# EAGLE design makeict-security-server-V2016-3-29 (EAGLE 7.5.0)
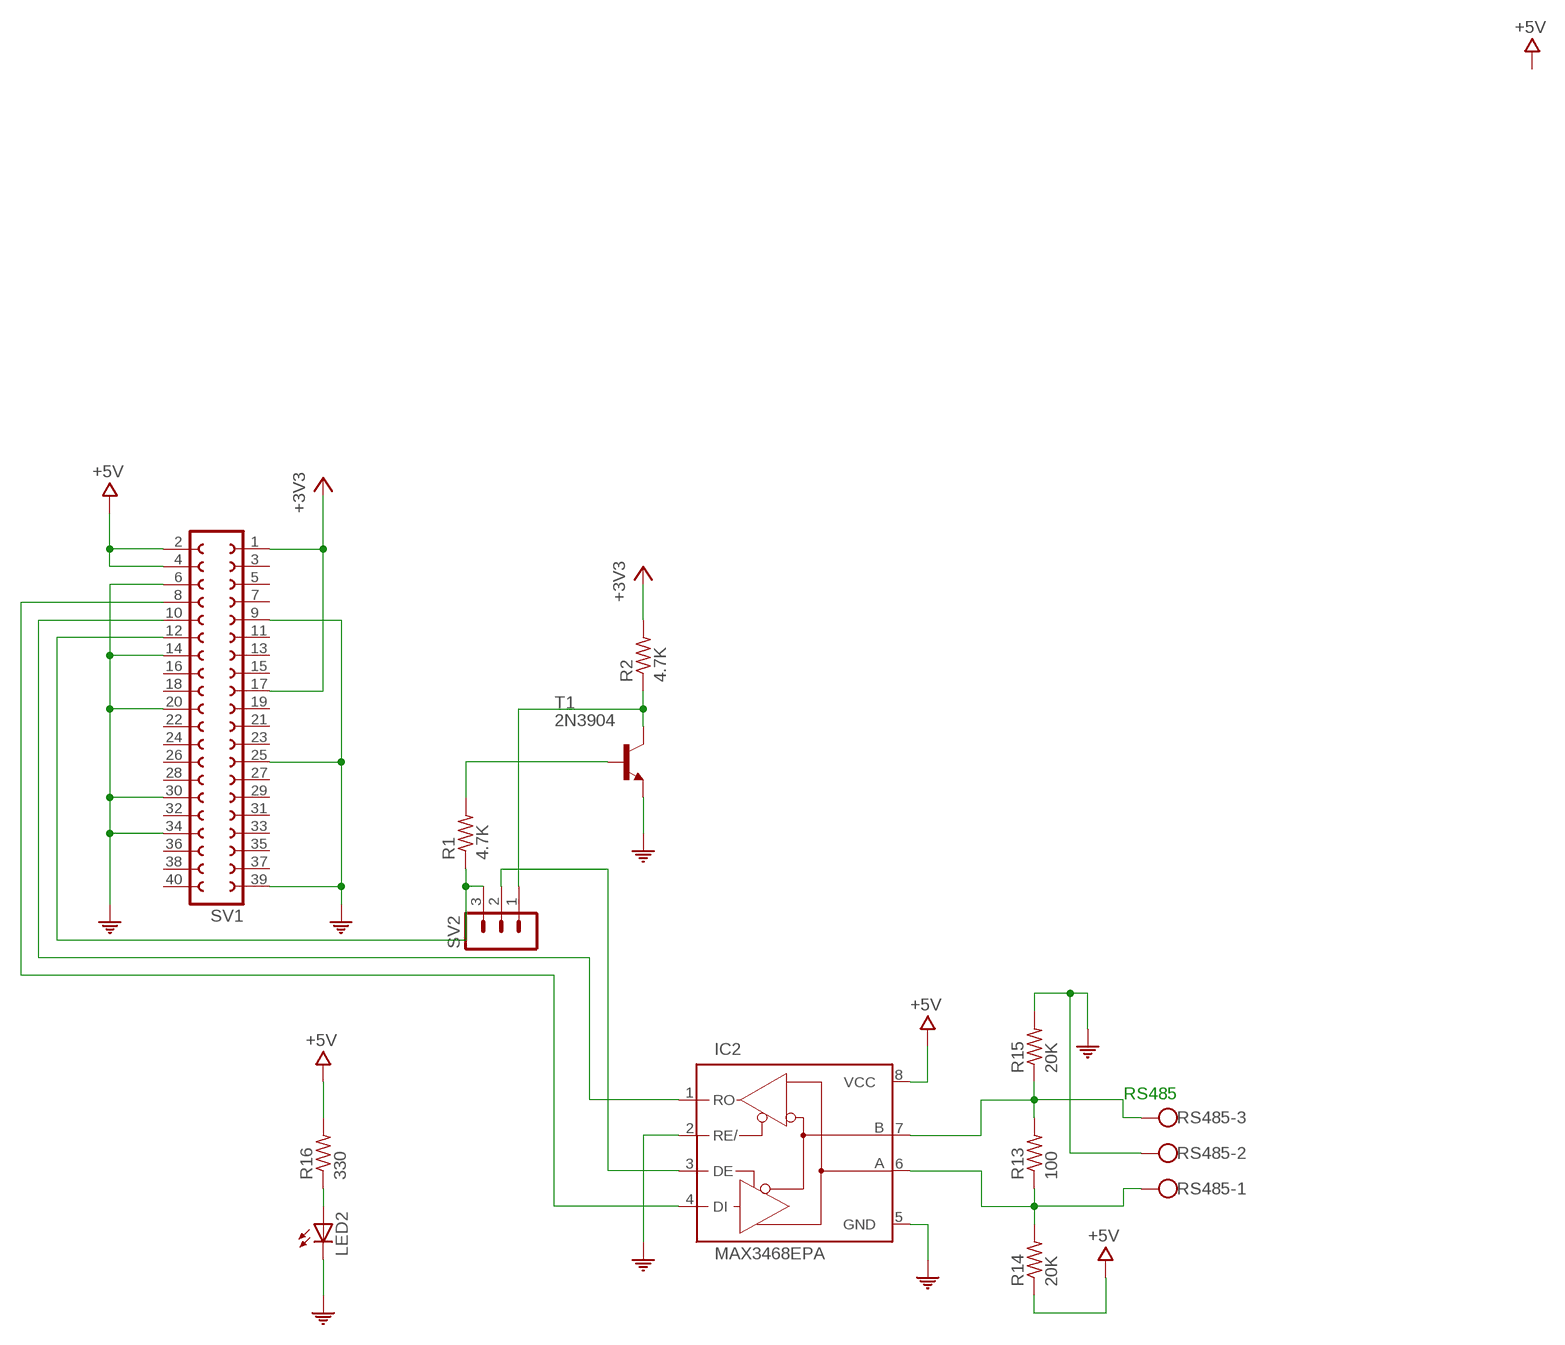
[diagram p0: schematic, sheet 1]

## Parts
IC2  MAX3468EPA  [DIL08]
LED2  LED3MM  [LED3MM]
R1  4.7K  R-US_0207/10  [0207/10]
R2  4.7K  R-US_0207/10  [0207/10]
R13  100  R-US_0207/10  [0207/10]
R14  20K  R-US_0207/10  [0207/10]
R15  20K  R-US_0207/10  [0207/10]
R16  330  R-US_0207/10  [0207/10]
RS485  W237-103  [W237-103]
SV1  FE20-2  [FE20-2]
SV2  MA03-1  [MA03-1]
T1  2N3904  [TO92]

## Nets
+3V3: R2.2 SV1.1 SV1.17
+5V: IC2.8(VCC) R14.1 R16.2 SV1.2 SV1.4
COM: IC2.2(RE/) IC2.5(GND) LED2.K(C) R15.2 RS485.2 SV1.6 SV1.9 SV1.14 SV1.20 SV1.25 SV1.30 SV1.34 SV1.39 T1.3(E)
D7: IC2.4(DI) SV1.8
D8: IC2.3(DE) SV2.2
N$1: R1.1 SV1.12 SV2.3
N$2: R1.2 T1.2(B)
N$3: R2.1 SV2.1 T1.1(C)
N$4: IC2.7(B) R13.2 R15.1 RS485.3
N$5: IC2.6(A) R13.1 R14.2 RS485.1
N$12: LED2.A R16.1
N$24: IC2.1(RO) SV1.10
Unconnected: SV1.3 SV1.5 SV1.7 SV1.11 SV1.13 SV1.15 SV1.16 SV1.18 SV1.19 SV1.21 SV1.22 SV1.23 SV1.24 SV1.26 SV1.27 SV1.28 SV1.29 SV1.31 SV1.32 SV1.33 SV1.35 SV1.36 SV1.37 SV1.38 SV1.40

## Notes on the sheet
- RS485

## Library data of the parts
IC2 = maxim:MAX34*: +5V, Fail-Safe, 40Mbps, Profibus RS-485/RS-422 Transceivers Source: MAX3465-MAX3469.pdf; MPN: MAX3468EPA+; OC_FARNELL: unknown; OC_NEWARK: 78M5804
LED2 = SparkFun-LED:LED: LEDs Standard schematic elements and footprints for 5mm, 3mm, 1206, and 0603 sized LEDs. 5mm - Spark Fun Electronics SKU : COM-00529 (and others)
R1 R2 R13-R16 = resistor:R-US_: RESISTOR, American symbol
RS485 = con-wago-500:W237-103: WAGO SCREW CLAMP; MPN: 237-103; OC_FARNELL: unknown; OC_NEWARK: 18M7116
SV1 = con-lsta:FE20-2: FEMALE HEADER; OC_FARNELL: unknown; OC_NEWARK: unknown
SV2 = con-lstb:MA03-1: PIN HEADER; OC_FARNELL: unknown; OC_NEWARK: unknown
T1 = transistor:2N3904: NPN TRANSISTOR

## Board
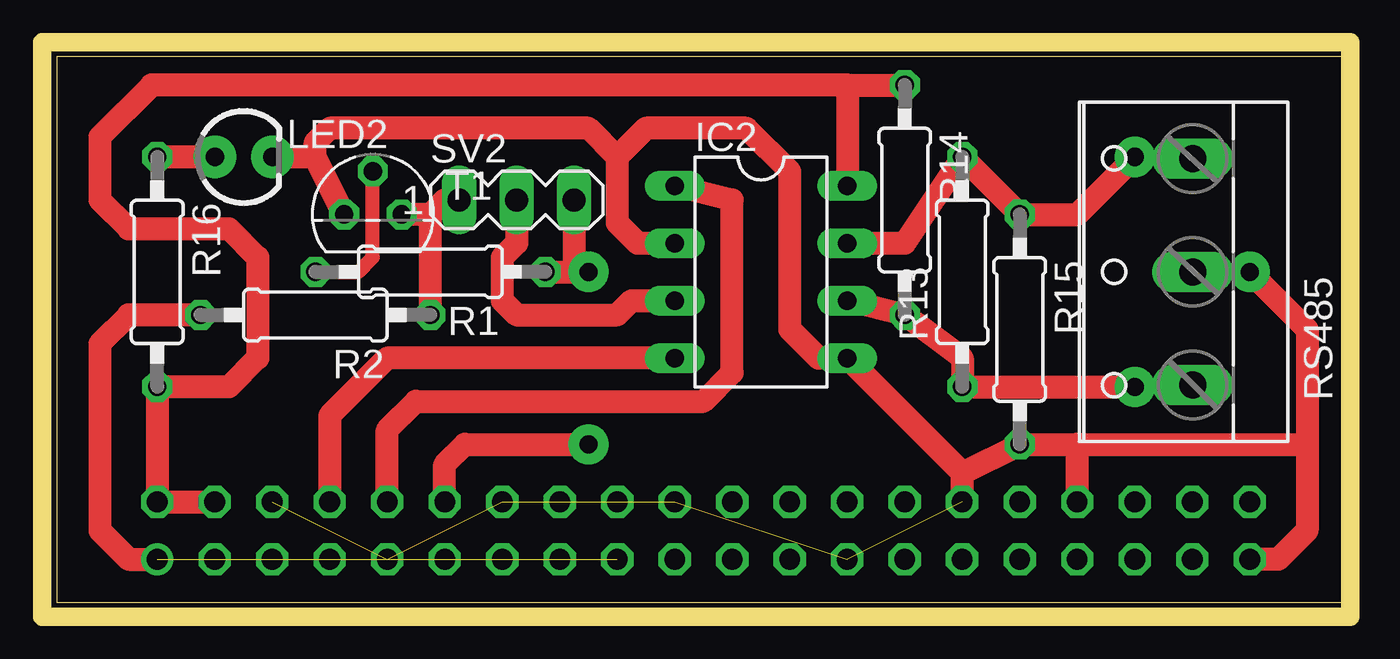
[diagram p1: board, top side]
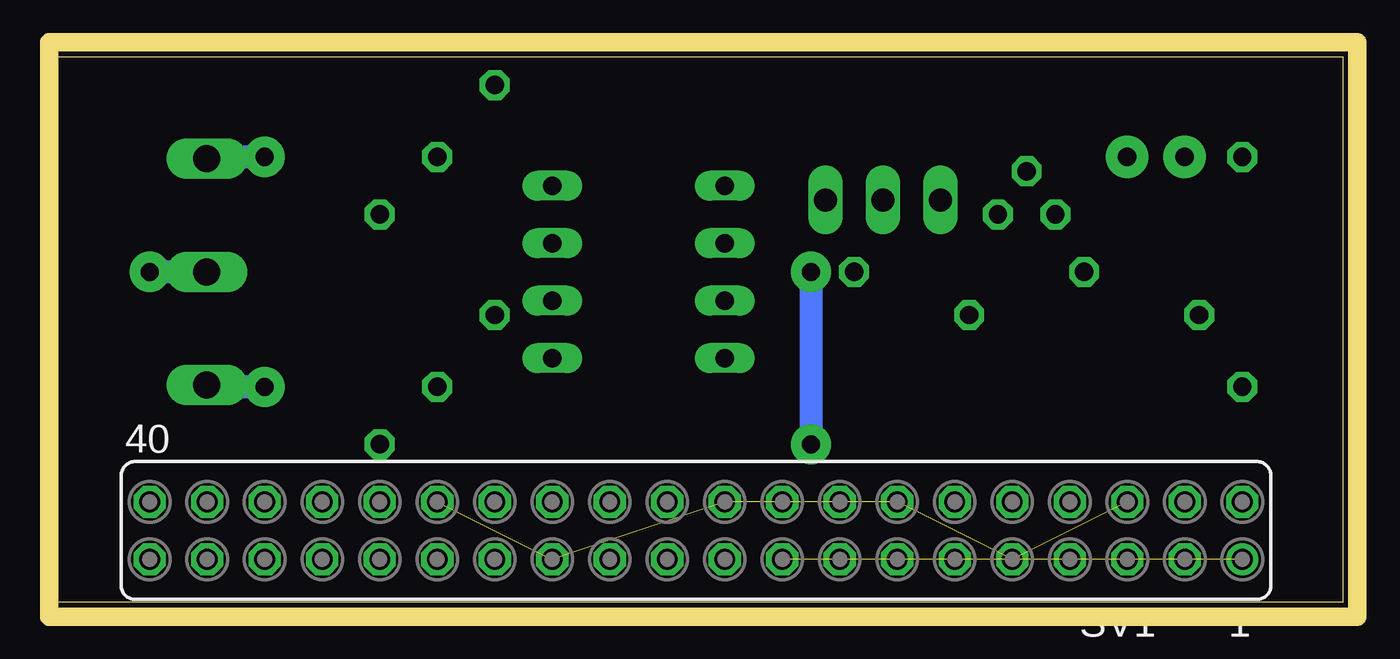
[diagram p2: board, bottom side, seen from below]

Size 56.82 x 24.12 mm. Coordinates in mm from the lower left corner, seen from the top.
Outline: 0,0 56.82,0 56.82,24.12 0,24.12 0,0
Copper layers (1*16): Top 0.035mm / dielectric 1.5mm / Bottom 0.035mm
Design rules "default": minimum track width 10mil, minimum drill 24mil, track to track 8mil, track to pad 8mil, pad to pad 8mil, via to via 8mil, smd to smd 8mil, copper to edge 40mil, drill to drill 8mil, minimum pad ring 10mil, minimum via ring 8mil, stop-mask expansion 4mil, vias tented up to drill 0mil, thermal gap 10mil
Milling: 4 lines

### Footprints (pad centres in the part's own frame; a part is rotated, then mirrored left to right if it is on the bottom)
DIL08 = drill 0.813 long: 1 -3.81,-3.81; 2 -1.27,-3.81; 3 1.27,-3.81; 4 3.81,-3.81; 5 3.81,3.81; 6 1.27,3.81; 7 -1.27,3.81; 8 -3.81,3.81
LED3MM = drill 0.813 pad 1.88: A -1.27,0; K 1.27,0
0207/10 = drill 0.813 octagon: 1 -5.08,0; 2 5.08,0
W237-103 = drill 1.194 long: 1 -5,-1.29; 2 0,-1.29; 3 5,-1.29
FE20-2 = drill 0.914: 1 -24.13,1.27 | drill 0.914 octagon: 2 -24.13,-1.27; 3 -21.59,1.27; 4 -21.59,-1.27; 5 -19.05,1.27; 6 -19.05,-1.27; 7 -16.51,1.27; 8 -16.51,-1.27; 9 -13.97,1.27; 10 -13.97,-1.27; 11 -11.43,1.27; 12 -11.43,-1.27; 13 -8.89,1.27; 14 -8.89,-1.27; 15 -6.35,1.27; 16 -6.35,-1.27; 17 -3.81,1.27; 18 -3.81,-1.27; 19 -1.27,1.27; 20 -1.27,-1.27; 21 1.27,1.27; 22 1.27,-1.27; 23 3.81,1.27; 24 3.81,-1.27; 25 6.35,1.27; 26 6.35,-1.27; 27 8.89,1.27; 28 8.89,-1.27; 29 11.43,1.27; 30 11.43,-1.27; 31 13.97,1.27; 32 13.97,-1.27; 33 16.51,1.27; 34 16.51,-1.27; 35 19.05,1.27; 36 19.05,-1.27; 37 21.59,1.27; 38 21.59,-1.27; 39 24.13,1.27; 40 24.13,-1.27
MA03-1 = drill 1.016 long: 1 -2.54,0; 2 0,0; 3 2.54,0
TO92 = drill 0.813 octagon: 1 1.27,0; 2 0,1.905; 3 -1.27,0

### Placement (x,y rotation side)
IC2  31.11,14.61 270 top
LED2  8.26,19.68 0 top
R1  16.51,14.61 180 top
R2  11.43,12.7 180 top
R13  40.01,14.61 90 top
R14  37.47,17.78 270 top
R15  42.55,12.06 270 top
R16  4.45,14.61 270 top
RS485  48.9,14.61 90 top
SV1  28.57,3.17 180 bottom
SV2  20.32,17.78 0 top
T1  13.97,17.14 0 top

### Tracks (layer width: path | path; a pad name or v marks a point on that pad's centre or on a via)
+3V3  (1 unrouted)
  Top 1.016: R2.2 3.17,12.7 1.91,11.43 1.91,3.17 3.17,1.91 SV1.1
+5V
  Top 1.016: 34.92,22.86 R14.1 | SV1.4 SV1.2 R16.2 7.62,9.53 8.89,10.79 8.89,15.24 7.62,16.51 3.17,16.51 1.91,17.78 1.91,20.57 4.2,22.86 34.92,22.86 | 34.92,22.86 IC2.8
COM  (via drill 0.8 pad 1.78)  (5 unrouted)
  Top 1.016: SV1.30 40.01,5.71 | 40.01,5.71 R15.2 45.09,6.99 | v52.7,14.61 55.24,12.06 55.24,6.99 | 55.24,6.99 55.24,3.17 53.98,1.91 SV1.39 | 45.09,6.99 55.24,6.99 | 40.01,5.71 IC2.5 33.66,10.79 32.38,12.06 32.38,19.05 30.48,20.95 26.04,20.95 24.77,19.68 | 24.77,19.68 24.77,16.77 25.66,15.88 IC2.2 | T1.3 11.43,19.68 | 11.43,19.68 11.43,20.32 12.06,20.95 23.5,20.95 24.77,19.68 | 11.43,19.68 LED2.K | SV1.34 45.09,6.99
  Bottom 1.016: RS485.2 v52.7,14.61
D7
  Top 1.016: IC2.4 14.61,10.79 12.06,8.26 SV1.8
D8
  Top 1.016: SV2.2 20.32,15.88 19.68,15.24 19.68,13.34 20.32,12.7 24.77,12.7 25.4,13.34 IC2.3
N$1  (via drill 0.8 pad 1.78)
  Top 1.016: SV1.12 17.14,6.09 18.04,6.99 v23.5,6.99 | R1.1 22.86,14.61 | 22.86,14.61 v23.5,14.61 | SV2.3 22.86,14.61
  Bottom 1.016: v23.5,14.61 v23.5,6.99
N$2
  Top 0.61: R1.2 13.34,14.61 13.97,15.24 T1.2
N$3
  Top 1.016: SV2.1 17.14,17.78 16.51,17.14 | 16.51,17.14 T1.1 | R2.1 16.51,17.14
N$4  (via drill 0.8 pad 1.78)
  Top 1.016: v47.62,19.68 45.09,17.14 R15.1 R13.2 37.47,15.88 IC2.7
  Bottom 1.016: v47.62,19.68 50.1,19.68 RS485.3
N$5  (via drill 0.8 pad 1.78)
  Top 1.016: v47.62,9.53 R13.1 40.01,10.79 R14.2 IC2.6
  Bottom 1.016: v47.62,9.53 50.1,9.53 RS485.1
N$12
  Top 1.016: LED2.A R16.1
N$24
  Top 1.016: SV1.10 14.61,7.62 15.88,8.89 28.57,8.89 29.84,10.16 29.84,17.78 IC2.1